# EAGLE schematic base_rs232_A (EAGLE 4.09)
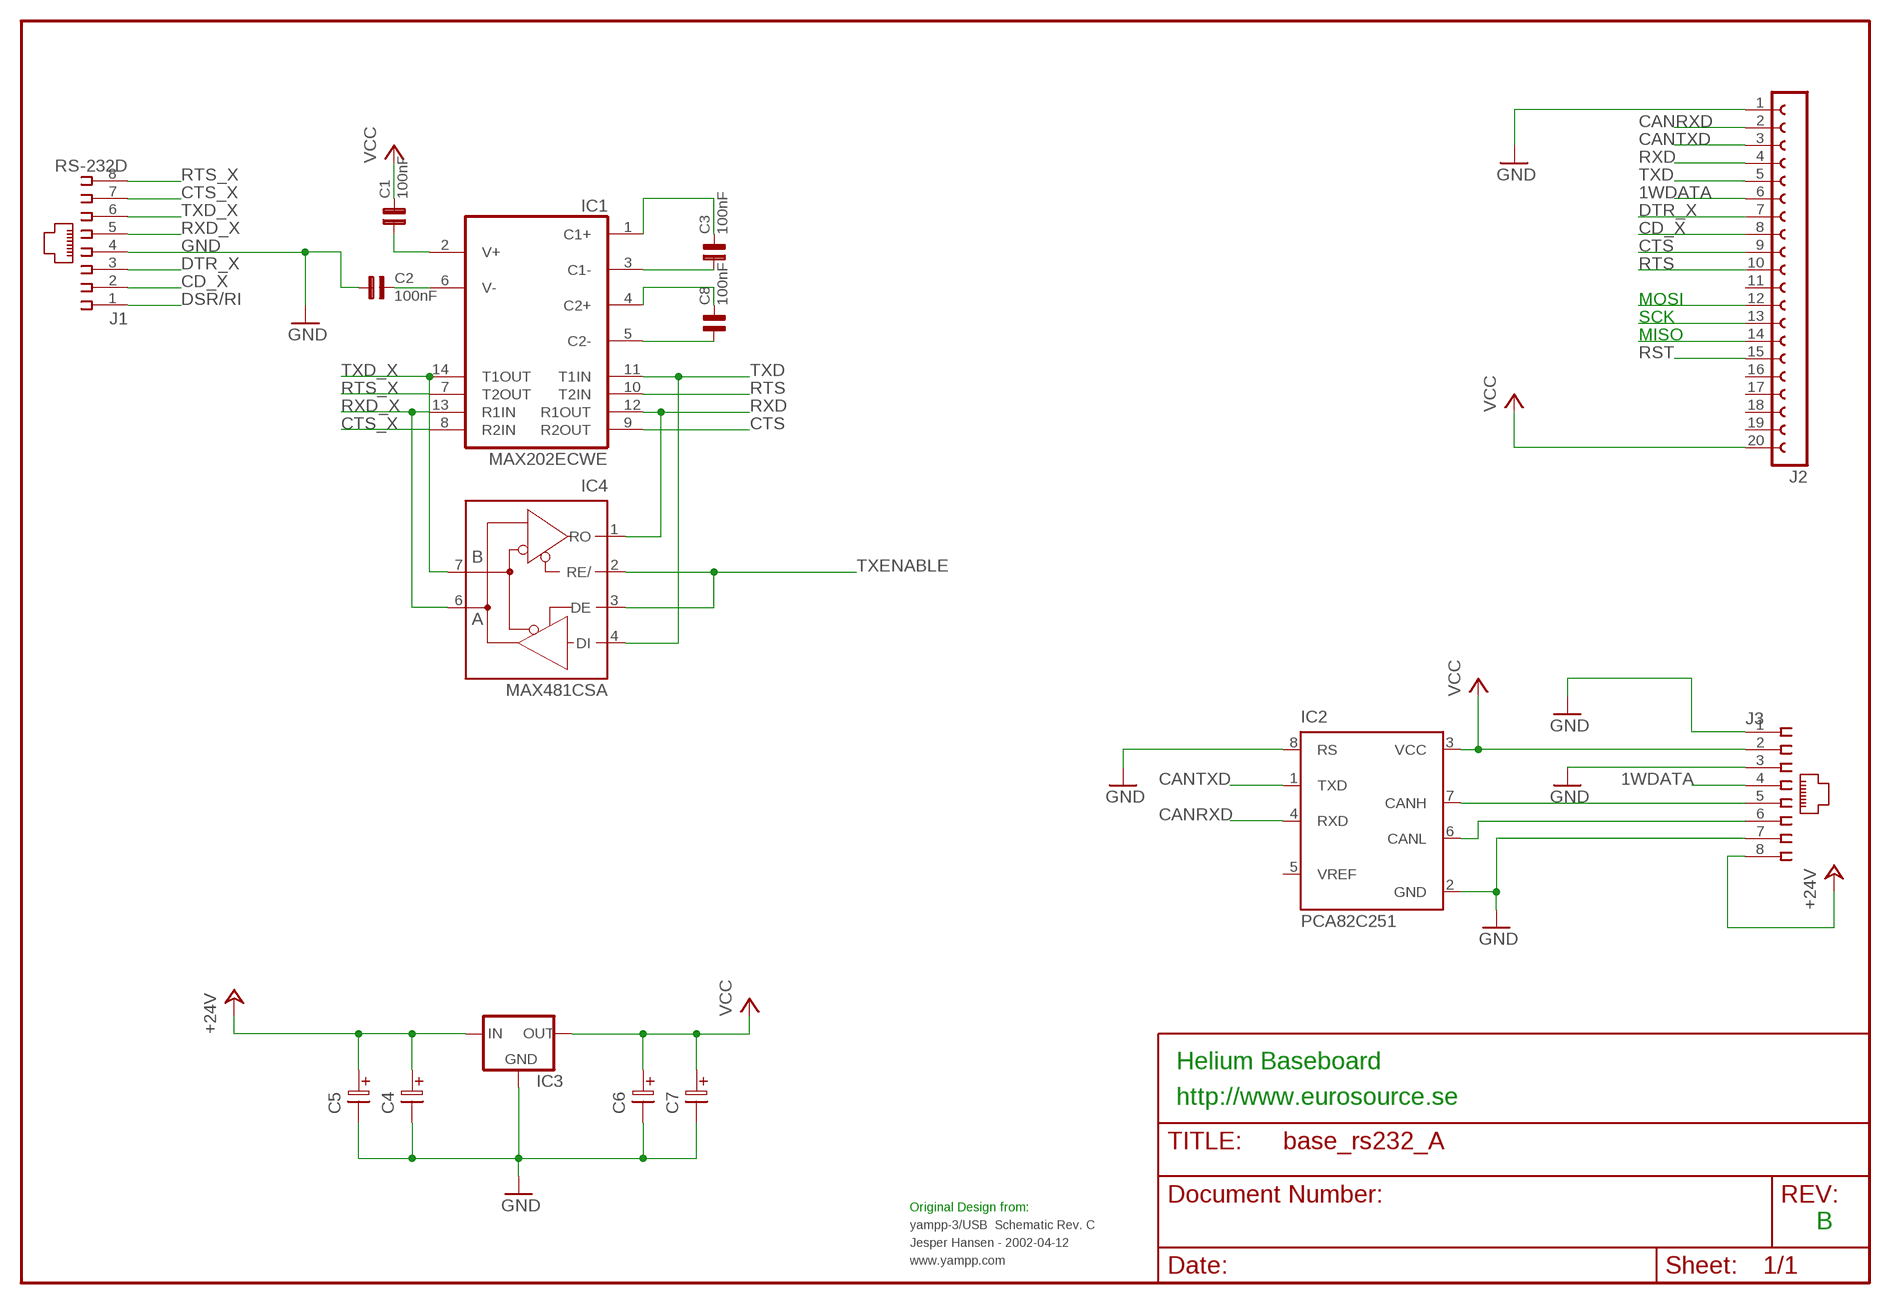
[diagram p0: schematic, sheet 1]

## Parts
C1  100nF  C0805  [C0805]
C2  100nF  C0805  [C0805]
C3  100nF  C0805  [C0805]
C4  ELC-2,5  [ES-2,5]
C5  ELC-5  [ES-5]
C6  ELC-2,5  [ES-2,5]
C7  ELC-2,5  [ES-2,5]
C8  100nF  C0805  [C0805]
IC1  MAX202ECWE  [SO16L]
IC2  PCA82C251  PCA82C250  [DIL08]
IC3  78XXL  [78XXL]
IC4  MAX481CSA  [SO08]
J1  RS-232D  555162-1  [555162-1]
J2  FE20-1  [FE20]
J3  555162-1  [555162-1]

## Nets
1WDATA: J2.6 J3.4
+24V: C4.1 C5.1 IC3.IN J3.8
AD5: J2.12
AD6: J2.13
AD7: J2.14
CANH: IC2.7(CANH) J3.5
CANL: IC2.6(CANL) J3.6
CANRXD: IC2.4(RXD) J2.2
CANTXD: IC2.1(TXD) J2.3
CD_X: J1.2 J2.8
CTS: IC1.9(R2OUT) J2.9
CTS_X: IC1.8(R2IN) J1.7
DSR/RI: J1.1
DTR_X: J1.3 J2.7
GND: C2.1 C4.2 C5.2 C6.2 C7.2 IC2.2(GND) IC2.8(RS) IC3.GND J1.4 J2.1 J3.3 J3.7
N$1: J3.1 ; supply symbol labelled GND
N$2: C1.1 IC1.2(V+)
N$3: C2.2 IC1.6(V-)
N$4: C3.1 IC1.3(C1-)
N$5: C3.2 IC1.1(C1+)
N$6: C8.1 IC1.5(C2-)
N$7: C8.2 IC1.4(C2+)
RST: J2.15
RTS: IC1.10(T2IN) J2.10
RTS_X: IC1.7(T2OUT) J1.8
RXD: IC1.12(R1OUT) IC4.1(RO) J2.4
RXD_X: IC1.13(R1IN) IC4.6(A) J1.5
TXD: IC1.11(T1IN) IC4.4(DI) J2.5
TXD_X: IC1.14(T1OUT) IC4.7(B) J1.6
TXENABLE: IC4.2(RE/) IC4.3(DE)
VCC: C1.2 C6.1 C7.1 IC2.3(VCC) IC3.OUT J2.20 J3.2
Unconnected: IC2.5(VREF) J2.11 J2.16 J2.17 J2.18 J2.19

## Notes on the sheet
- MOSI
- SCK
- MISO
- Helium Baseboard
- http://www.eurosource.se
- Original Design from:
- yampp-3/USB  Schematic Rev. C | B
- Jesper Hansen - 2002-04-12
- www.yampp.com

## Power pins joined to a net without a drawn wire
GND: IC1.15(GND) IC4.5(GND)
VCC: IC1.16(VCC) IC4.8(VCC)

## Library data of the parts
C1-C3 C8 = SMD-SORT:C0805
C4 C6 C7 = discrete:ELC-2,5
C5 = discrete:ELC-5
IC1 = maxim:MAX202ECWE: RS232 TRANSEIVER
IC2 = micro-philips:PCA82C250: CAN CONTROLLER INTERFACE
IC3 = v-reg:78XXL: VOLTAGE REGULATOR
IC4 = maxim:MAX481CSA: RS485 TRANSEIVER
J1 J3 = con-amp:555162-1: AMP connector
J2 = con-lsta:FE20-1: FEMALE HEADER